# Altium project Mainboard.PrjPcb
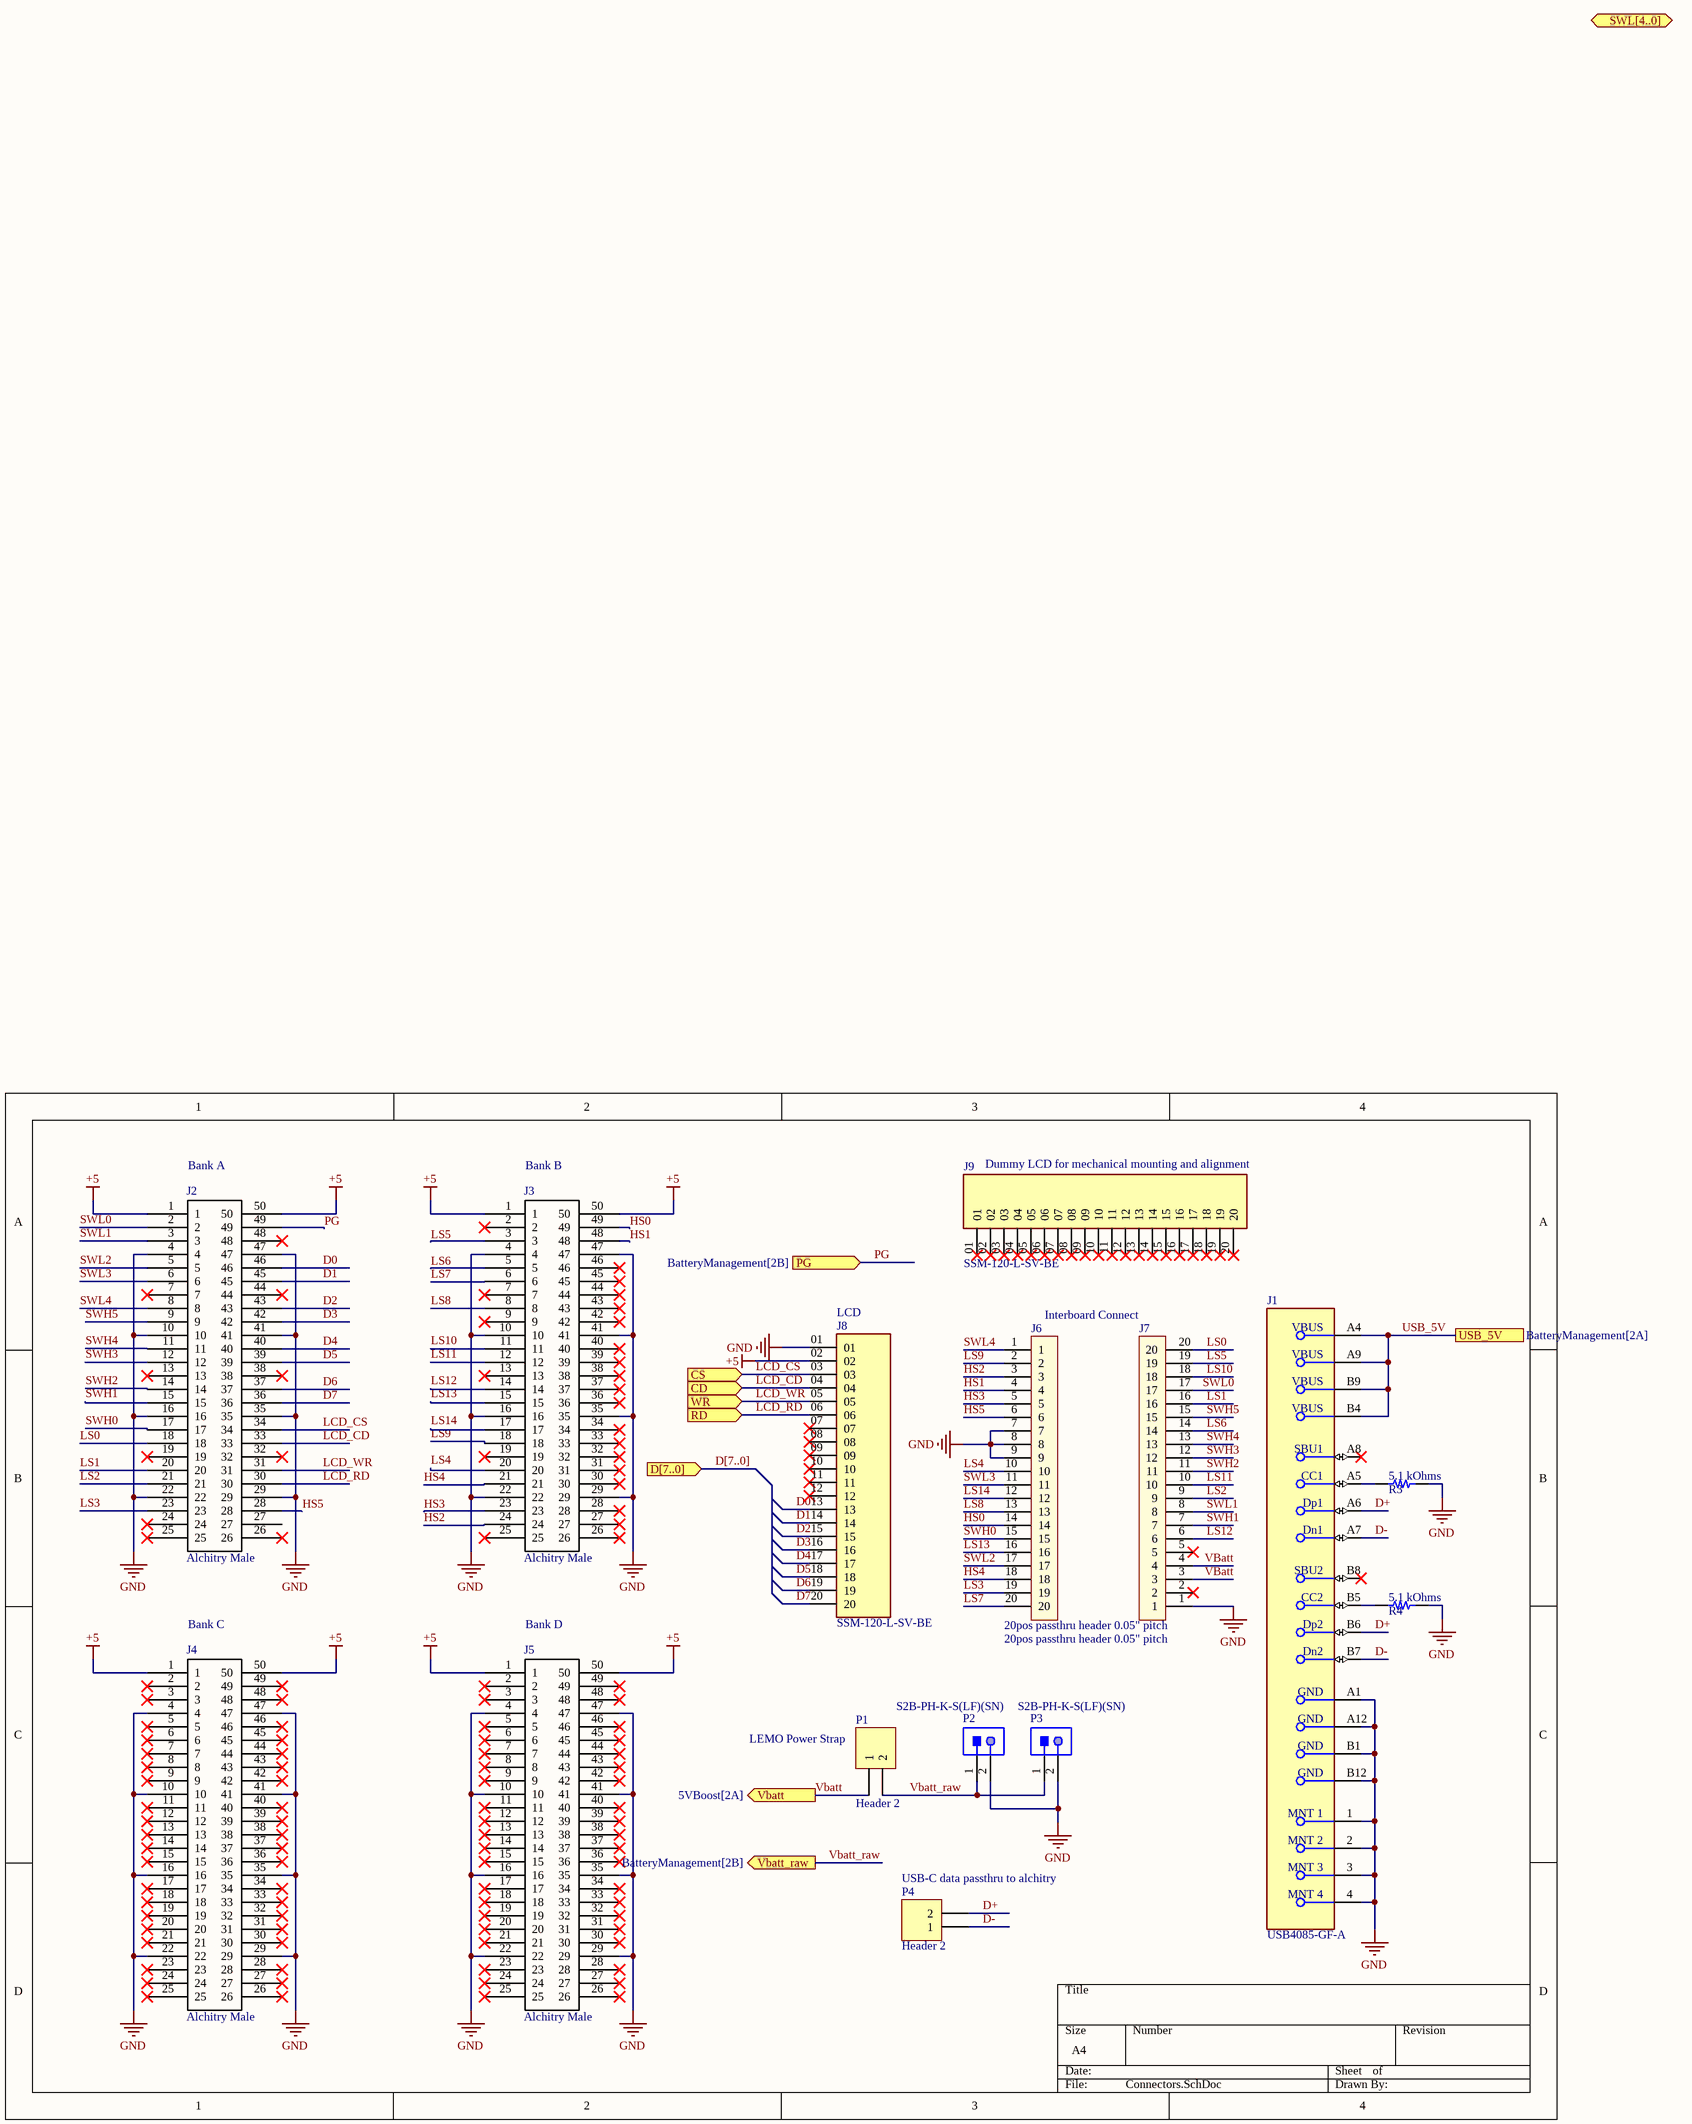
[diagram p0: Connectors.SchDoc]
3 sheets, 36 parts. Net scope: flat (ports and power ports of the same name join across sheets).
Board file: MainBoard V1.PcbDoc
Sheets:
  Connectors.SchDoc
  BatteryManagement.SchDoc
  5VBoost.SchDoc

## Sheet Connectors.SchDoc
size A4; SheetNumber: 1; SheetTotal: 3

### Parts
J1  USB4085-GF-A  [FP-USB4085-GF-A-MFG]
J2  Alchitry Male  [AlchitryMale]
J3  Alchitry Male  [AlchitryMale]
J4  Alchitry Male  [AlchitryMale]
J5  Alchitry Male  [AlchitryMale]
J6  20pos passthru header 0.05" pitch  [M50-3132045]
J7  20pos passthru header 0.05" pitch  [M50-3132045]
J8  SSM-120-L-SV-BE  [SAMTEC_SSM-120-L-SV-BE]
J9  SSM-120-L-SV-BE  [SAMTEC_SSM-120-L-SV-BE]
P1  Header 2  [HDR1X2]
P2  S2B-PH-K-S(LF)(SN)  [JST-S2B-PH-K-S_V]
P3  S2B-PH-K-S(LF)(SN)  [JST-S2B-PH-K-S_V]
P4  Header 2  [HDR1X2]
R3  5.1 kOhms  [RES 0805_2012]
R4  5.1 kOhms  [RES 0805_2012]

### Ports
CD (in), CS (in), D[7..0] (in), PG (in, see BatteryManagement[2B]), RD (in), SWL[4..0] (bidir), USB_5V (see BatteryManagement[2A]), Vbatt (out, see 5VBoost[2A]), Vbatt_raw (out, see BatteryManagement[2B]), WR (in)

### Nets
+5: J2.1 J2.50 J3.1 J3.50 J4.1 J4.50 J5.1 J5.50 J8.02
GND: J1.1(MNT_1) J1.2(MNT_2) J1.3(MNT_3) J1.4(MNT_4) J1.A1(GND) J1.A12(GND) J1.B1(GND) J1.B12(GND) J2.4 J2.10 J2.16 J2.22 J2.29 J2.35 J2.41 J2.47 J3.4 J3.10 J3.16 J3.22 J3.29 J3.35 J3.41 J3.47 J4.4 J4.10 J4.16 J4.22 J4.29 J4.35 J4.41 J4.47 J5.4 J5.10 J5.16 J5.22 J5.29 J5.35 J5.41 J5.47 J6.7 J6.8 J6.9 J7.1 J8.01 P2.2 P3.2 R3.2 R4.2
D0: J2.46 J8.13
D1: J2.45 J8.14
D2: J2.43 J8.15
D3: J2.42 J8.16
D4: J2.40 J8.17
D5: J2.39 J8.18
D6: J2.37 J8.19
D7: J2.36 J8.20
D+: J1.A6(Dp1) J1.B6(Dp2) P4.2
D-: J1.A7(Dn1) J1.B7(Dn2) P4.1
HS0: J3.49 J6.14
HS1: J3.48 J6.4
HS2: J3.24 J6.3
HS3: J3.23 J6.5
HS4: J3.21 J6.18
HS5: J2.28 J6.6
LCD_CD: J2.33 J8.04 ; port CD
LCD_CS: J2.34 J8.03 ; port CS
LCD_RD: J2.30 J8.06 ; port RD
LCD_WR: J2.31 J8.05 ; port WR
LS0: J2.18 J7.20
LS1: J2.20 J7.16
LS2: J2.21 J7.9
LS3: J2.23 J6.19
LS4: J3.20 J6.10
LS5: J3.3 J7.19
LS6: J3.5 J7.14
LS7: J3.6 J6.20
LS8: J3.8 J6.13
LS9: J3.18 J6.2
LS10: J3.11 J7.18
LS11: J3.12 J7.10
LS12: J3.14 J7.6
LS13: J3.15 J6.16
LS14: J3.17 J6.12
PG: J2.49 ; port PG
SWH0: J2.17 J6.15
SWH1: J2.15 J7.7
SWH2: J2.14 J7.11
SWH3: J2.12 J7.12
SWH4: J2.11 J7.13
SWH5: J2.9 J7.15
SWL0: J2.2 J7.17
SWL1: J2.3 J7.8
SWL2: J2.5 J6.17
SWL3: J2.6 J6.11
SWL4: J2.8 J6.1
USB_5V: J1.A4(VBUS) J1.A9(VBUS) J1.B4(VBUS) J1.B9(VBUS) ; port USB_5V
Vbatt: J7.3 J7.4 P1.1 ; port Vbatt
Vbatt_raw: P1.2 P2.1 P3.1 ; port Vbatt_raw
NetJ1_A5: J1.A5(CC1) R3.1
NetJ1_B5: J1.B5(CC2) R4.1

Not connected (* = marked no-connect by the designer): J1 A8(SBU1)* B8(SBU2)*; J2 7* 13* 19* 24* 25* 26* 27 32* 38* 44* 48*; J3 2* 7* 9* 13* 19* 25* 26* 27* 28* 30* 31* 32* 33* 34* 36* 37* 38* 39* 40* 42* 43* 44* 45* 46*; J4 2* 3* 5* 6* 7* 8* 9* 11* 12* 13* 14* 15* 17* 18* 19* 20* 21* 23* 24* 25* 26* 27* 28* 30* 31* 32* 33* 34* 36* 37* 38* 39* 40* 42* 43* 44* 45* 46* 48* 49*; J5 2* 3* 5* 6* 7* 8* 9* 11* 12* 13* 14* 15* 17* 18* 19* 20* 21* 23* 24* 25* 26* 27* 28* 30* 31* 32* 33* 34* 36* 37* 38* 39* 40* 42* 43* 44* 45* 46* 48* 49*; J7 2* 5*; J8 07* 08* 09* 10* 11* 12*; J9 01* 02* 03* 04* 05* 06* 07* 08* 09* 10* 11* 12* 13* 14* 15* 16* 17* 18* 19* 20*

### Buses and harness runs
bus D[7..0] = port D[7..0]

### Notes on the sheet
- (near J2) Bank A
- (near J3) Bank B
- Dummy LCD for mechanical mounting and alignment
- (near J8) LCD
- Interboard Connect
- (near J4) Bank C
- (near J5) Bank D
- (near P1) LEMO Power Strap
- (near P4) USB-C data passthru to alchitry

### Library data of the parts
J1 = CMP-196119-000001-2: CONN RCPT USB2.0 TYPE C 24POS RA; Gender: Receptacle; Number of Positions: 16; USB Standard: USB 2.0; Orientation: Right Angle; Contact Plating: Gold; Contact Material: Copper Alloy
J6 J7 = 20pos passthru header 0.05" pitch: M50-3132045; System: Connector
J8 J9 = SSM-120-L-SV-BE: 20 Position Receptacle, Bottom Entry Connector 0.100 (2.54mm) Surface Mount Gold; MF: Samtec; MP: SSM-120-L-SV-BE; Value: *; Purchase-URL: https://pricing.snapeda.com/search/part/SSM-120-L-SV-BE/?ref=eda; Check_prices: https://www.snapeda.com/parts/SSM-120-L-SV-BE/Samtec/view-part/2796009/?ref=eda; Package: None; Digi-Key_Part_Number: 612-SSM-120-L-SV-BE-K-TR-ND; SnapEDA_Link: https://www.snapeda.com/parts/SSM-120-L-SV-BE/Samtec/view-part/2796009/?ref=snap
P1 = CMP-002-00141-1: Header, 2-Pin; Signal Integrity: Connector; LatestRevisionDate: 17-Jul-2002; LatestRevisionNote: Re-released for DXP Platform.; Publisher: Altium Limited; Source: Miscellaneous Connectors.SchLib; Pins: 2; Design Item ID: Header 2; Component Type: Standard
P2 P3 = CMP-1755-00004-1: Male Header, Pitch 2 mm, 1 x 2 Position, Height 4.8 mm, Tail Length 3.4 mm, -25 to 85 degC, RoHS, Bulk; Case\Package: Radial; Tolerance: 20%; Capacitance: 10 uF; Voltage Rating (DC): 50 V; Packaging: Bulk; ComponentLink1URL: http://www.jst-mfg.com/product/pdf/eng/ePH.pdf; Radiation Hardening: No; Height: 11 mm; Package Quantity: 200; PackageDescription: Male Header, Pitch 2 mm, 1 x 2 Position, Height 4.8 mm, Tail Length 3.4 mm; PackageReference: S2B-PH-K-S; Diameter: 5 mm; Pins: 2; Mount: Through Hole; Max Operating Temperature: 85 degC; Min Operating Temperature: -40 degC; ComponentLink1Description: Datasheet; DatasheetVersion: Dec-12; Length: 11 mm; Lead Pitch: 2 mm; REACH SVHC: No SVHC; Voltage Rating: 50 V; RoHSCompliant: true
P4 = Header 2: Header, 2-Pin; LatestRevisionDate: 17-Jul-2002; LatestRevisionNote: Re-released for DXP Platform.; Publisher: Altium Limited
R3 R4 = RC0805JR-075K1L: RES 5.1K OHM 5% 1/8W 0805; Manufacturer: Yageo; Power (Watts): 0.125W, 1/8W; Temperature Coefficient: ±100ppm/°C; Part Number: RC0805JR-075K1L; Value: 5.1 kOhms; ComponentLink1Description: Datasheet; ComponentLink1URL: https://www.yageo.com/upload/media/product/productsearch/datasheet/rchip/PYu-RC_Group_51_RoHS_L_10.pdf; ComponentLink2Description: DigiKey Link; ComponentLink2URL: https://www.digikey.com/en/products/detail/yageo/RC0805JR-075K1L/728338; Composition: Thick Film; Device Package: 0805 (2012 Metric); Features: Moisture Resistant; Height - Seated (Max): 0.024" (0.60mm); LastUpdated: 2023-01-02 8:43:52 PM; Lifecycle Status: Active; Minimum Order: 1; Number of Terminations: 2; Operating Temperature: -55°C ~ 155°C; Package / Case: 0805 (2012 Metric); Packaging: CutTape; PartId: 41971; Part Status: Active; Price: 0.01; Resistance: 5.1 kOhms; Series: RC_L; Size / Dimension: 0.079" L x 0.049" W (2.00mm x 1.25mm); Supplier 1: DigiKey; Supplier Part Number 1: 311-5.1KARCT-ND; Supplier Device Package: 0805; Tolerance: ±5%

## Sheet BatteryManagement.SchDoc
size A4; SheetNumber: 3; SheetTotal: 3
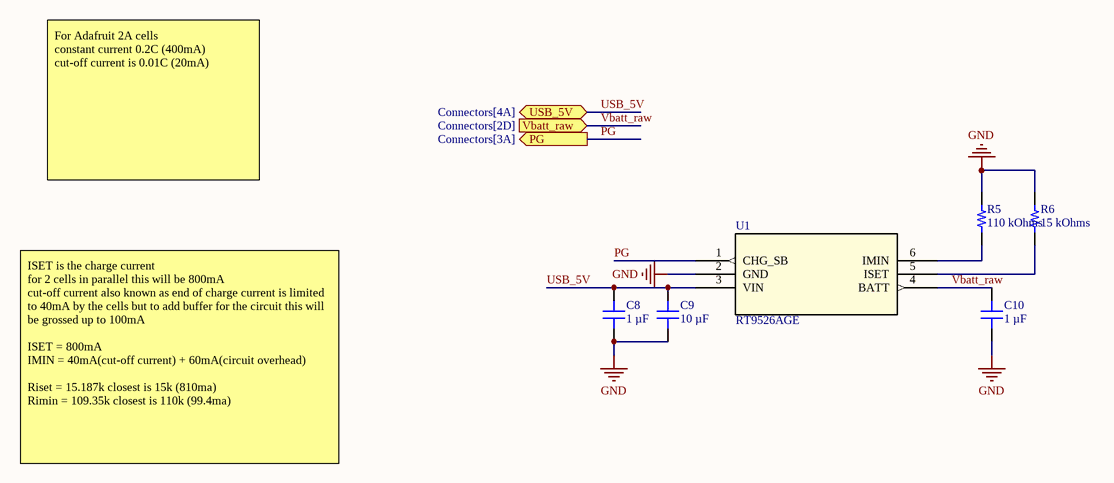
[diagram p1: BatteryManagement.SchDoc]

### Parts
C8  1 µF  [CAP 0603_1608]
C9  10 µF  [CAP 0603_1608]
C10  1 µF  [CAP 0603_1608]
R5  110 kOhms  [RES 0805_2012]
R6  15 kOhms  [RES 0805_2012]
U1  RT9526AGE  [SOT-23-6_RIT]

### Ports
PG (out, see Connectors[3A]), USB_5V (bidir, see Connectors[4A]), Vbatt_raw (in, see Connectors[2D])

### Nets
GND: C8.1 C9.1 C10.1 R5.2 R6.2 U1.2(GND)
PG: U1.1(CHG_SB) ; port PG
USB_5V: C8.2 C9.2 U1.3(VIN) ; port USB_5V
Vbatt_raw: C10.2 U1.4(BATT) ; port Vbatt_raw
NetR5_1: R5.1 U1.6(IMIN)
NetR6_1: R6.1 U1.5(ISET)

### Notes on the sheet
- For Adafruit 2A cells
  constant current 0.2C (400mA)
  cut-off current is 0.01C (20mA)
- ISET is the charge current
  for 2 cells in parallel this will be 800mA
  cut-off current also known as end of charge current is limited to 40mA by the cells but to add buffer for the circuit this will be grossed up to 100mA
  ISET = 800mA
  IMIN = 40mA(cut-off current) + 60mA(circuit overhead)
  Riset = 15.187k closest is 15k (810ma)
  Rimin = 109.35k closest is 110k (99.4ma)

### Library data of the parts
C8 C10 = C1608X7R1C105K080AC: CAP CER 1UF 16V X7R 0603; manufacturer: TDK Corporation; Tolerance: ±10%; Part Number: C1608X7R1C105K080AC; Value: 1 µF; Applications: General Purpose; Capacitance: 1 µF; componentlink1description: Datasheet; componentlink1url: https://product.tdk.com/info/en/catalog/datasheets/mlcc_commercial_general_en.pdf?ref_disty=digikey; componentlink2description: DigiKey Link; componentlink2url: https://www.digikey.com/en/products/detail/tdk-corporation/C1608X7R1C105K080AC/634395; Device Package: 0603 (1608 Metric); Features: Low ESL; lastupdated: 2023-01-03 8:06:54 PM; Lifecycle Status: Active; Minimum Order: 1; Mounting Type: Surface Mount, MLCC; Operating Temperature: -55°C ~ 125°C; Package / Case: 0603 (1608 Metric); packaging: TapeAndReel; partid: 36324; Part Status: Active; price: 0.01; series: C; Size / Dimension: 0.063" L x 0.031" W (1.60mm x 0.80mm); Supplier 1: DigiKey; Supplier Part Number 1: 445-1604-1-ND; Temperature Coefficient: X7R; Thickness (Max): 0.035" (0.90mm); Voltage - Rated: 16V
C9 = GRM188R61E106KA73J: CAP CER 10UF 25V X5R 0603; manufacturer: Murata Electronics; Tolerance: ±10%; Part Number: GRM188R61E106KA73J; Value: 10 µF; Applications: General Purpose; Capacitance: 10 µF; componentlink1description: Datasheet; componentlink1url: https://search.murata.co.jp/Ceramy/image/img/A01X/G101/ENG/GRM188R61E106KA73-01A.pdf; componentlink2description: DigiKey Link; componentlink2url: https://www.digikey.com/en/products/detail/murata-electronics/GRM188R61E106KA73J/9887674; Device Package: 0603 (1608 Metric); lastupdated: 2023-01-03 8:06:37 PM; Lifecycle Status: Active; Minimum Order: 1; Mounting Type: Surface Mount, MLCC; Operating Temperature: -55°C ~ 85°C; Package / Case: 0603 (1608 Metric); packaging: TapeAndReel; partid: 39529; Part Status: Active; price: 0.04; series: GRM; Size / Dimension: 0.063" L x 0.031" W (1.60mm x 0.80mm); Supplier 1: DigiKey; Supplier Part Number 1: 490-GRM188R61E106KA73JCT-ND; Temperature Coefficient: X5R; Thickness (Max): 0.039" (1.00mm); Voltage - Rated: 25V
R5 = RC0805FR-07110KL: RES 110K OHM 1% 1/8W 0805; Manufacturer: Yageo; Power (Watts): 0.125W, 1/8W; Temperature Coefficient: ±100ppm/°C; Part Number: RC0805FR-07110KL; Value: 110 kOhms; ComponentLink1Description: Datasheet; ComponentLink1URL: https://www.yageo.com/upload/media/product/productsearch/datasheet/rchip/PYu-RC_Group_51_RoHS_L_10.pdf; ComponentLink2Description: DigiKey Link; ComponentLink2URL: https://www.digikey.com/en/products/detail/yageo/RC0805FR-07110KL/727560; Composition: Thick Film; Device Package: 0805 (2012 Metric); Features: Moisture Resistant; Height - Seated (Max): 0.024" (0.60mm); LastUpdated: 2023-01-02 8:44:02 PM; Lifecycle Status: Active; Minimum Order: 1; Number of Terminations: 2; Operating Temperature: -55°C ~ 155°C; Package / Case: 0805 (2012 Metric); Packaging: CutTape; PartId: 39573; Part Status: Active; Price: 0.01; Resistance: 110 kOhms; Series: RC_L; Size / Dimension: 0.079" L x 0.049" W (2.00mm x 1.25mm); Supplier 1: DigiKey; Supplier Part Number 1: 311-110KCRCT-ND; Supplier Device Package: 0805; Tolerance: ±1%
R6 = RC0805FR-1315KL: RES 15K OHM 1% 1/8W 0805; Manufacturer: Yageo; Power (Watts): 0.125W, 1/8W; Temperature Coefficient: ±100ppm/°C; Part Number: RC0805FR-1315KL; Value: 15 kOhms; ComponentLink1Description: Datasheet; ComponentLink1URL: https://www.yageo.com/upload/media/product/productsearch/datasheet/rchip/PYu-RC_Group_51_RoHS_L_11.pdf; ComponentLink2Description: DigiKey Link; ComponentLink2URL: https://www.digikey.com/en/products/detail/yageo/RC0805FR-1315KL/13694228; Composition: Thick Film; Device Package: 0805 (2012 Metric); Features: Moisture Resistant; Height - Seated (Max): 0.024" (0.60mm); LastUpdated: 2023-01-02 8:42:49 PM; Lifecycle Status: Active; Minimum Order: 1; Number of Terminations: 2; Operating Temperature: -55°C ~ 155°C; Package / Case: 0805 (2012 Metric); Packaging: CutTape; PartId: 66554; Part Status: Active; Price: 0.01; Resistance: 15 kOhms; Series: RC_L; Size / Dimension: 0.079" L x 0.049" W (2.00mm x 1.25mm); Supplier 1: DigiKey; Supplier Part Number 1: 13-RC0805FR-1315KLCT-ND; Supplier Device Package: 0805; Tolerance: ±1%
U1 = RT9526AGE: No Description Available; Mfr_Name: Richtek Technology; Copyright: Copyright (C) 2023 Ultra Librarian. All rights reserved.; Manufacturer_Part_Number: RT9526AGE; Digi-Key_Part_Number_1: 1028-1359-2-ND; Digi-Key_Part_Number_2: 1028-1359-1-ND; Digi-Key_Part_Number_3: 1028-1359-6-ND; RefDes: RefDes; Type: DEV

## Sheet 5VBoost.SchDoc
size A4; SheetNumber: 3; SheetTotal: 3
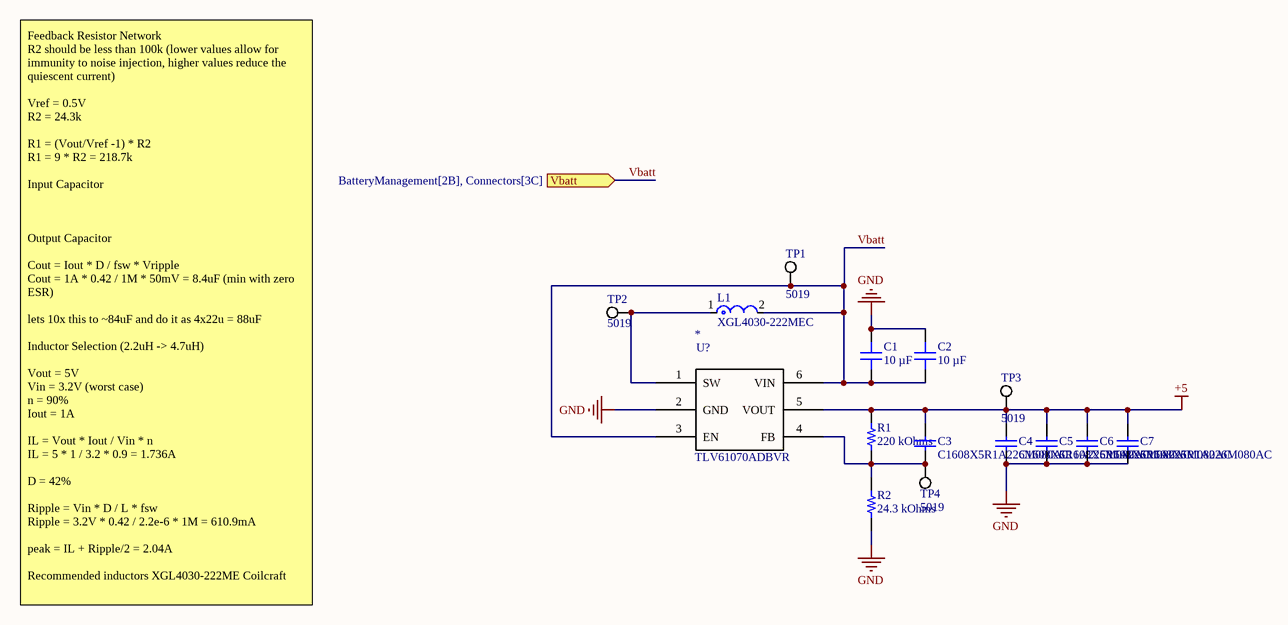
[diagram p2: 5VBoost.SchDoc]

### Parts
*  TLV61070ADBVR  [SOT95P280X145-6N]
C1  10 µF  [CAP 0603_1608]
C2  10 µF  [CAP 0603_1608]
C3  C1608X5R1A226M080AC  [CAPC1608X100X20ML10]
C4  C1608X5R1A226M080AC  [CAPC1608X100X20ML10]
C5  C1608X5R1A226M080AC  [CAPC1608X100X20ML10]
C6  C1608X5R1A226M080AC  [CAPC1608X100X20ML10]
C7  C1608X5R1A226M080AC  [CAPC1608X100X20ML10]
L1  XGL4030-222MEC  [FP-XGL4030-MFG]
R1  220 kOhms  [RES 0603_1608]
R2  24.3 kOhms  [RES 0603_1608]
TP1  5019  [KSTN-5019_V]
TP2  5019  [KSTN-5019_V]
TP3  5019  [KSTN-5019_V]
TP4  5019  [KSTN-5019_V]

### Ports
Vbatt (in, see BatteryManagement[2B], Connectors[3C])

### Nets
+5: *.5(VOUT) C3.2 C4.2 C5.2 C6.2 C7.2 R1.2 TP3.1
GND: *.2(GND) C1.2 C2.2 C4.1 C5.1 C6.1 C7.1 R2.1
Vbatt: *.3(EN) *.6(VIN) C1.1 C2.1 L1.2 TP1.1 ; port Vbatt
Net*_1: *.1(SW) L1.1 TP2.1
Net*_4: *.4(FB) C3.1 R1.1 R2.2 TP4.1

### Notes on the sheet
- Feedback Resistor Network
  R2 should be less than 100k (lower values allow for immunity to noise injection, higher values reduce the quiescent current)
  Vref = 0.5V
  R2 = 24.3k
  R1 = (Vout/Vref -1) * R2
  R1 = 9 * R2 = 218.7k
  Input Capacitor
  Output Capacitor
  Cout = Iout * D / fsw * Vripple
  Cout = 1A * 0.42 / 1M * 50mV = 8.4uF (min with zero ESR)
  lets 10x this to ~84uF and do it as 4x22u = 88uF
  Inductor Selection (2.2uH -> 4.7uH)
  Vout = 5V
  Vin = 3.2V (worst case)
  n = 90%
  Iout = 1A
  IL = Vout * Iout / Vin * n
  IL = 5 * 1 / 3.2 * 0.9 = 1.736A
  D = 42%
  Ripple = Vin * D / L * fsw
  Ripple = 3.2V * 0.42 / 2.2e-6 * 1M = 610.9mA
  peak = IL + Ripple/2 = 2.04A
  Recommended inductors XGL4030-222ME Coilcraft
- (in symbol TLV61070ADBVR) U?

### Library data of the parts
C1 C2 = GRM188R61E106KA73J: as C9 on sheet BatteryManagement; Part Number: GRM188R61E106KA73J; Value: 10 µF; Applications: General Purpose; Capacitance: 10 µF; componentlink1description: Datasheet; componentlink1url: https://search.murata.co.jp/Ceramy/image/img/A01X/G101/ENG/GRM188R61E106KA73-01A.pdf; componentlink2description: DigiKey Link; componentlink2url: https://www.digikey.com/en/products/detail/murata-electronics/GRM188R61E106KA73J/9887674; Device Package: 0603 (1608 Metric); lastupdated: 2023-01-03 8:06:37 PM; Lifecycle Status: Active; Minimum Order: 1; Mounting Type: Surface Mount, MLCC; Operating Temperature: -55°C ~ 85°C; Package / Case: 0603 (1608 Metric); packaging: TapeAndReel; partid: 39529; Part Status: Active; price: 0.04; series: GRM; Size / Dimension: 0.063" L x 0.031" W (1.60mm x 0.80mm); Supplier 1: DigiKey; Supplier Part Number 1: 490-GRM188R61E106KA73JCT-ND; Temperature Coefficient: X5R; Thickness (Max): 0.039" (1.00mm); Voltage - Rated: 25V
C3-C7 = CMP-2000-05441-1: Chip Capacitor, 22 uF, +/- 20%, 10 V, -55 to 85 degC, 0603 (1608 Metric), RoHS, Tape and Reel; Manufacturer: TDK; PCN Part Number: MLCCPartNumberChange30/Nov/2012; Voltage - Rated: 10V; Product Training Modules: CSeriesGeneralApplicationsSEAT,CCV,andTVCLDesignToolsGuidetoReplacinganElectrolyticCapacitorwithanMLCC; Other Names: 445-9077-1; Design Resources: 20WNon-IsolatedBuckLEDDriverUsingPLLNK460KG; Online Catalog: CSeries,GeneralPurpose; Capacitance: 22µF; Temperature Coefficient: X5R; Kits: 445-9014-KIT-ND-KITMLCC100PF-22UF060310-50V; Packaging: CutTape(CT); Standard Package: 1; Package / Case: 0603(1608Metric); Lead Style: -; Features: -; Ratings: -; Operating Temperature: -55degC~85degC; Applications: GeneralPurpose; Package Reference: 603; Datasheet URL: http://download.siliconexpert.com/pdfs/2015/4/21/15/54/45/779/tdk_/manual/37024850441143360mlcc_commercial_general_en.pdf; Datasheet Version: Mar-15; Mounting Type: SurfaceMount,MLCC; Lead Spacing: -; Size / Dimension: 0.063"Lx0.031"W(1.60mmx0.80mm); Height - Seated (Max): -; Package Description: 2-Pin Surface Mount Device, Body 1.6 x 0.8 mm; Manufacturer URL: http://www.tdk.com/; RoHS Information: RoHSCertificate-MLCC; Tolerance: ±20%; Series: C; Thickness (Max): 0.035"(0.90mm); Family: CeramicCapacitors; Category: Capacitors
L1 = CMP-11268-000073-1: Inductor Power Shielded Wirewound 2.2uH 20% 1MHz Composite 8.7A 15mOhm DCR Automotive T/R
R1 = RC0603FR-07220KL: RES 220K OHM 1% 1/10W 0603; Manufacturer: Yageo; Power (Watts): 0.1W, 1/10W; Temperature Coefficient: ±100ppm/°C; Part Number: RC0603FR-07220KL; Value: 220 kOhms; ComponentLink1Description: Datasheet; ComponentLink1URL: https://www.yageo.com/upload/media/product/productsearch/datasheet/rchip/PYu-RC_Group_51_RoHS_L_10.pdf; ComponentLink2Description: DigiKey Link; ComponentLink2URL: https://www.digikey.com/en/products/detail/yageo/RC0603FR-07220KL/727062; Composition: Thick Film; Device Package: 0603 (1608 Metric); Features: Moisture Resistant; Height - Seated (Max): 0.022" (0.55mm); LastUpdated: 2023-01-02 8:29:28 PM; Lifecycle Status: Active; Minimum Order: 1; Number of Terminations: 2; Operating Temperature: -55°C ~ 155°C; Package / Case: 0603 (1608 Metric); Packaging: CutTape; PartId: 19015; Part Status: Active; Price: 0.01; Resistance: 220 kOhms; Series: RC_L; Size / Dimension: 0.063" L x 0.031" W (1.60mm x 0.80mm); Supplier 1: DigiKey; Supplier Part Number 1: 311-220KHRCT-ND; Supplier Device Package: 0603; Tolerance: ±1%
R2 = RC0603FR-0724K3L: RES 24.3K OHM 1% 1/10W 0603; Manufacturer: Yageo; Power (Watts): 0.1W, 1/10W; Temperature Coefficient: ±100ppm/°C; Part Number: RC0603FR-0724K3L; Value: 24.3 kOhms; ComponentLink1Description: Datasheet; ComponentLink1URL: https://www.yageo.com/upload/media/product/productsearch/datasheet/rchip/PYu-RC_Group_51_RoHS_L_10.pdf; ComponentLink2Description: DigiKey Link; ComponentLink2URL: https://www.digikey.com/en/products/detail/yageo/RC0603FR-0724K3L/727078; Composition: Thick Film; Device Package: 0603 (1608 Metric); Features: Moisture Resistant; Height - Seated (Max): 0.022" (0.55mm); LastUpdated: 2023-01-02 8:30:16 PM; Lifecycle Status: Active; Minimum Order: 1; Number of Terminations: 2; Operating Temperature: -55°C ~ 155°C; Package / Case: 0603 (1608 Metric); Packaging: CutTape; PartId: 7644; Part Status: Active; Price: 0.01; Resistance: 24.3 kOhms; Series: RC_L; Size / Dimension: 0.063" L x 0.031" W (1.60mm x 0.80mm); Supplier 1: DigiKey; Supplier Part Number 1: 311-24.3KHRCT-ND; Supplier Device Package: 0603; Tolerance: ±1%
TP1-TP4 = CMP-1672-00008-1: Test Point, 1 Position SMD, RoHS, Tape and Reel; ComponentLink1Description: Manufacturer URL; Package Quantity: 1000; DatasheetVersion: 03/2014; Packaging: Tape and Reel; ComponentLink2URL: http://www.keyelco.com/product-pdf.cfm?p=1357; ComponentLink1URL: http://www.keyelco.com/; Mount: Surface Mount; Contact Plating: Silver; PackageDescription: 1-Pin Surface Mount Device, Body 3.81 x 2.03 mm; Pins: 1; RoHSCompliant: True; Mounting Technology: Surface Mount; ComponentLink2Description: Datasheet; PackageReference: 5019

## Nets that join several sheets
+5: Connectors (9 pins), 5VBoost (8 pins)
GND: Connectors (49 pins), BatteryManagement (6 pins), 5VBoost (8 pins)
PG: Connectors (J2.49), BatteryManagement (U1.1)
USB_5V: Connectors (J1.A4 J1.A9 J1.B4 J1.B9), BatteryManagement (C8.2 C9.2 U1.3)
Vbatt: Connectors (J7.3 J7.4 P1.1), 5VBoost (6 pins)
Vbatt_raw: Connectors (P1.2 P2.1 P3.1), BatteryManagement (C10.2 U1.4)